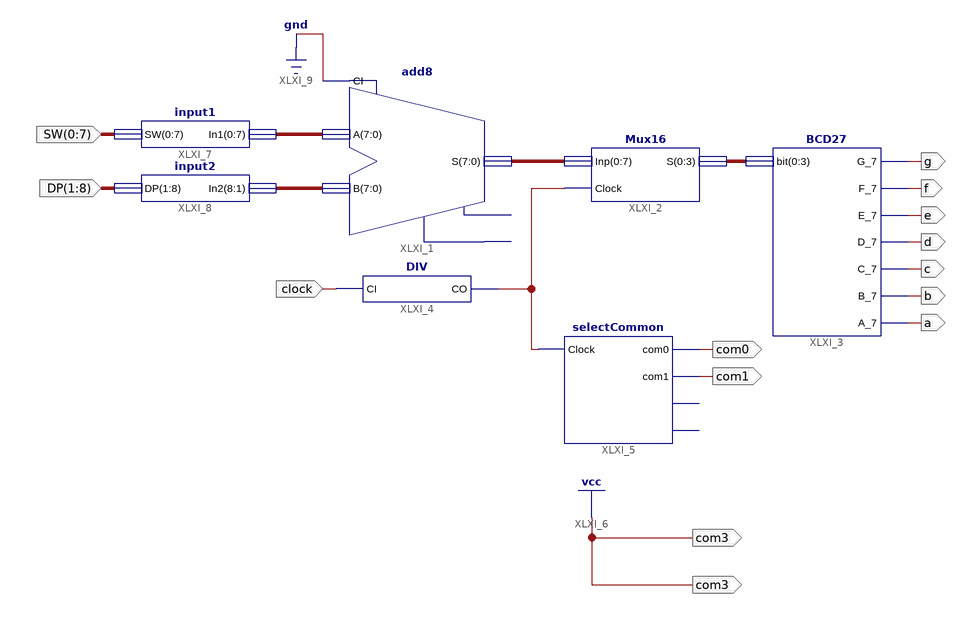
[diagram p0: schematic sheet 1]
// Xilinx ISE schematic Lab9.sch (spartan6) as structural Verilog: 7 symbols, 13 ports
module Lab9 (
  input  clock,
  input  [0:7] SW,
  input  [1:8] DP,
  output com0,
  output com1,
  output com3,
  output g,
  output f,
  output e,
  output d,
  output c,
  output b,
  output a
);

  wire XLXN_6;
  wire [3:0] XLXN_2;
  wire [7:0] In1, In2, XLXN_1;

  add8 XLXI_1 (
    .A(In1), .B(In2), .CI(1'b0),
    .S({XLXN_1[0], XLXN_1[1], XLXN_1[2], XLXN_1[3], XLXN_1[4], XLXN_1[5], XLXN_1[6], XLXN_1[7]}));  // open: CO, OFL
  Mux16 XLXI_2 (
    .Clock(XLXN_6),
    .Inp({XLXN_1[0], XLXN_1[1], XLXN_1[2], XLXN_1[3], XLXN_1[4], XLXN_1[5], XLXN_1[6], XLXN_1[7]}),
    .S({XLXN_2[0], XLXN_2[1], XLXN_2[2], XLXN_2[3]}));
  BCD27 XLXI_3 (
    .A_7(a), .\bit ({XLXN_2[0], XLXN_2[1], XLXN_2[2], XLXN_2[3]}), .B_7(b), .C_7(c), .D_7(d), .E_7(e),
    .F_7(f), .G_7(g));
  DIV XLXI_4 (.CI(clock), .CO(XLXN_6));
  selectCommon XLXI_5 (.Clock(XLXN_6), .com0(com0), .com1(com1));  // open: com2, com3
  input1 XLXI_7 (.In1(In1), .SW(SW));
  input2 XLXI_8 (.DP(DP), .In2(In2));

  assign com3 = 1'b1;
endmodule
